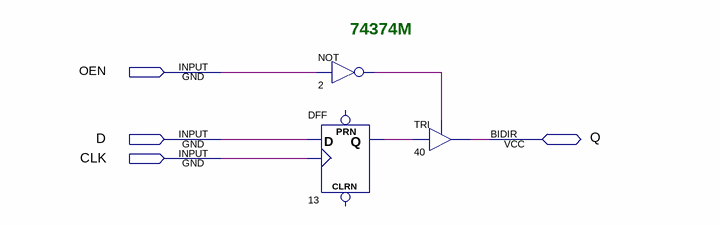
[diagram p0: schematic sheet]
// Quartus schematic 74374m.bdf as structural Verilog: 3 symbols, 4 pins
module \74374m  (
  input  OEN,
  input  D,
  input  CLK,
  inout  Q
);

  wire n2_out, n13_q;

  not u_2 (n2_out, OEN);
  DFF u_13 (.CLK(CLK), .D(D), .Q(n13_q));  // open: CLRN, PRN
  TRI u_40 (.IN(n13_q), .OE(n2_out), .OUT(Q));

  // Notes on the sheet:
  //   74374M
endmodule
